# EAGLE design icestampul1k (EAGLE 9.6.2)
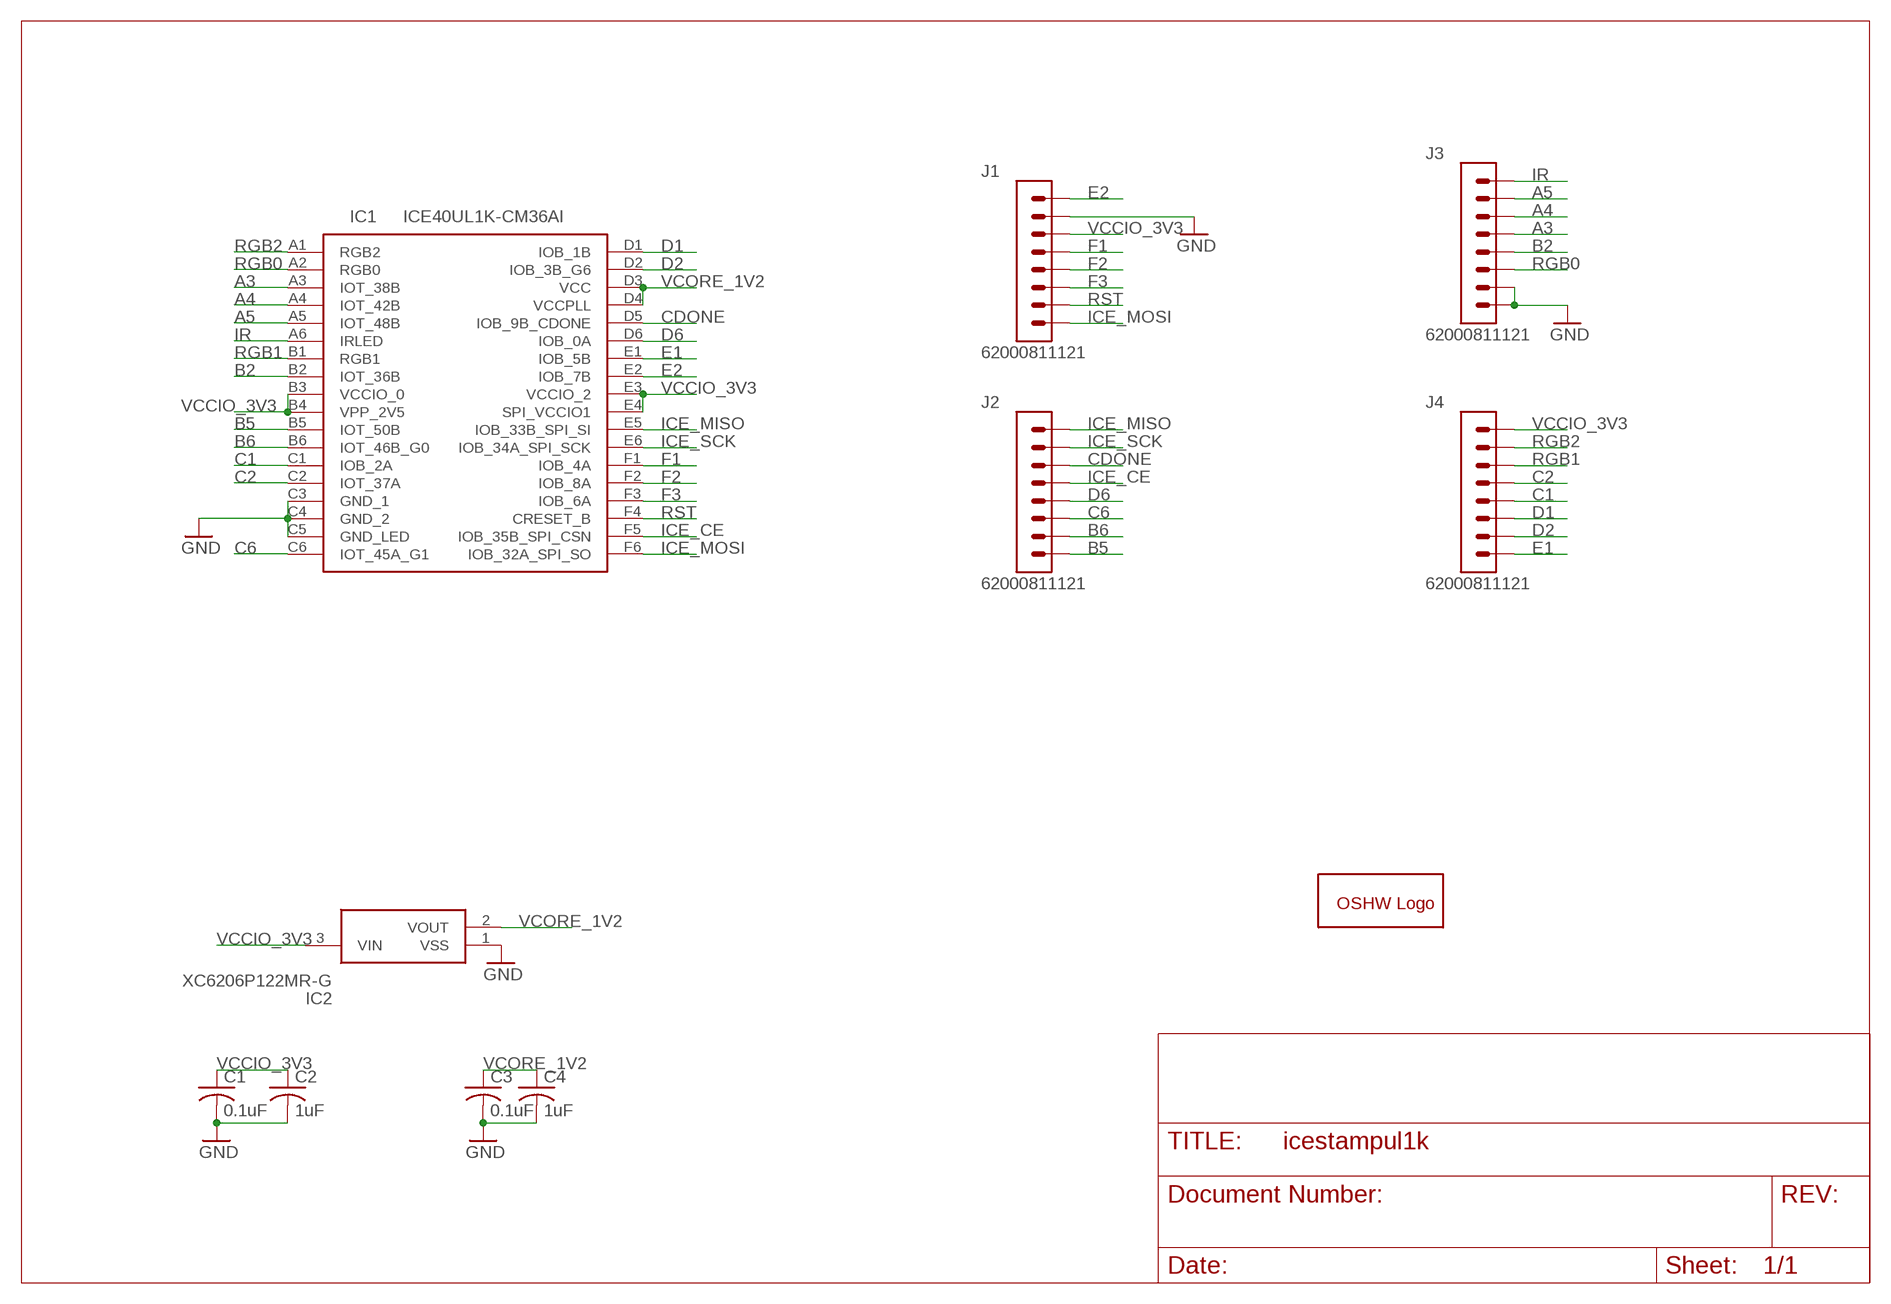
[diagram p0: schematic, sheet 1]

## Parts
C1  0.1uF  C-USC0603  [C0603]
C2  1uF  C-USC0603  [C0603]
C3  0.1uF  C-USC0603  [C0603]
C4  1uF  C-USC0603  [C0603]
GOLD_ORB_SM1  OSHWLOGOLOGO5MM  [OSHW_5MM]
IC1  ICE40UL1K-CM36AI  [BGA36C40P6X6_250X250X91]
IC2  XC6206P122MR-G  [SOT95P280X130-3N]
J1  62000811121  [62000811121]
J2  62000811121  [62000811121]
J3  62000811121  [62000811121]
J4  62000811121  [62000811121]

## Nets
A3: IC1.A3(IOT_38B) J3.4
A4: IC1.A4(IOT_42B) J3.3
A5: IC1.A5(IOT_48B) J3.2
B2: IC1.B2(IOT_36B) J3.5
B5: IC1.B5(IOT_50B) J2.8
B6: IC1.B6(IOT_46B_G0) J2.7
C1: IC1.C1(IOB_2A) J4.5
C2: IC1.C2(IOT_37A) J4.4
C6: IC1.C6(IOT_45A_G1) J2.6
CDONE: IC1.D5(IOB_9B_CDONE) J2.3
D1: IC1.D1(IOB_1B) J4.6
D2: IC1.D2(IOB_3B_G6) J4.7
D6: IC1.D6(IOB_0A) J2.5
E1: IC1.E1(IOB_5B) J4.8
E2: IC1.E2(IOB_7B) J1.1
F1: IC1.F1(IOB_4A) J1.4
F2: IC1.F2(IOB_8A) J1.5
F3: IC1.F3(IOB_6A) J1.6
GND: C1.2 C2.2 C3.2 C4.2 IC1.C3(GND_1) IC1.C4(GND_2) IC1.C5(GND_LED) IC2.1(VSS) J1.2 J3.7 J3.8
ICE_CE: IC1.F5(IOB_35B_SPI_CSN) J2.4
ICE_MISO: IC1.E5(IOB_33B_SPI_SI) J2.1
ICE_MOSI: IC1.F6(IOB_32A_SPI_SO) J1.8
ICE_SCK: IC1.E6(IOB_34A_SPI_SCK) J2.2
IR: IC1.A6(IRLED) J3.1
RGB0: IC1.A2(RGB0) J3.6
RGB1: IC1.B1(RGB1) J4.3
RGB2: IC1.A1(RGB2) J4.2
RST: IC1.F4(CRESET_B) J1.7
VCCIO_3V3: C1.1 C2.1 IC1.B3(VCCIO_0) IC1.B4(VPP_2V5) IC1.E3(VCCIO_2) IC1.E4(SPI_VCCIO1) IC2.3(VIN) J1.3 J4.1
VCORE_1V2: C3.1 C4.1 IC1.D3(VCC) IC1.D4(VCCPLL) IC2.2(VOUT)

## Library data of the parts
C1-C4 = adafruit:C-US: CAPACITOR, American symbol
GOLD_ORB_SM1 = oshw:OSHWLOGO: The OSHW logo for PCB layout
IC1 = ICE40UL1K-CM36AI:ICE40UL1K-CM36AI: FPGA - Field Programmable Gate Array FPGA iCE40-UltraLite 1.2V CBGA PKG Source: Datasheet <http://www.latticesemi.com/~/media/LatticeSemi/Documents/DataSheets/iCE/iCE40UltraLiteDataSheetDS1050.pdf>; ARROW_PART_NUMBER: ICE40UL1K-CM36AI; ARROW_PRICE-STOCK: https://www.arrow.com/en/products/ice40ul1k-cm36ai/lattice-semiconductor; DESCRIPTION: FPGA - Field Programmable Gate Array FPGA iCE40-UltraLite 1.2V CBGA PKG; HEIGHT: 0.91mm; MANUFACTURER_NAME: Lattice Semiconductor; MANUFACTURER_PART_NUMBER: ICE40UL1K-CM36AI; MOUSER_PART_NUMBER: 842-ICE40UL1K-CM36AI; MOUSER_PRICE-STOCK: https://www.mouser.co.uk/ProductDetail/Lattice/ICE40UL1K-CM36AI/?qs=XJu%252BLGjWfSAZhGGFZ7EiQg%3D%3D
IC2 = XC6206P122MR-G:XC6206P122MR-G: LDO Voltage Regulators 1uA Low Quiescent 3 Terminal, Low ESR Cap. Compatible, Voltage Regulator Source: Datasheet <https://www.torexsemi.com/file/xc6206/XC6206.pdf>; DESCRIPTION: LDO Voltage Regulators 1uA Low Quiescent 3 Terminal, Low ESR Cap. Compatible, Voltage Regulator; HEIGHT: 1.3mm; MANUFACTURER_NAME: Torex; MANUFACTURER_PART_NUMBER: XC6206P122MR-G; MOUSER_PART_NUMBER: 865-XC6206P122MR-G; MOUSER_PRICE-STOCK: https://www.mouser.co.uk/ProductDetail/Torex-Semiconductor/XC6206P122MR-G?qs=AsjdqWjXhJ%2F35%2FU%2FZk2JYg%3D%3D
J1-J4 = Headers:62000811121: THT Vertical Pin Header WR-PHD, Pitch 2.00 mm, Single Row, 8 pins Manufacturer's datasheet <https://datasheet.octopart.com/62000811121-W%C3%BCrth-Elektronik-datasheet-117282012.pdf>; CREATED_BY: PCBLayout.com; MANUFACTURER: Würth Elektronik; MPN: 62000811121

## Board
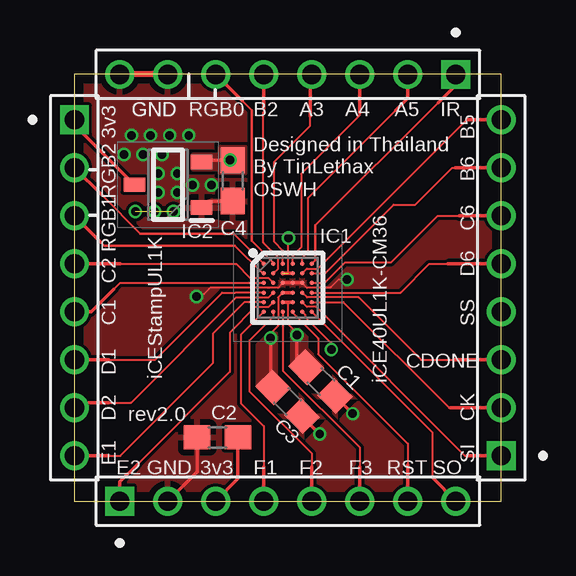
[diagram p1: board, top side]
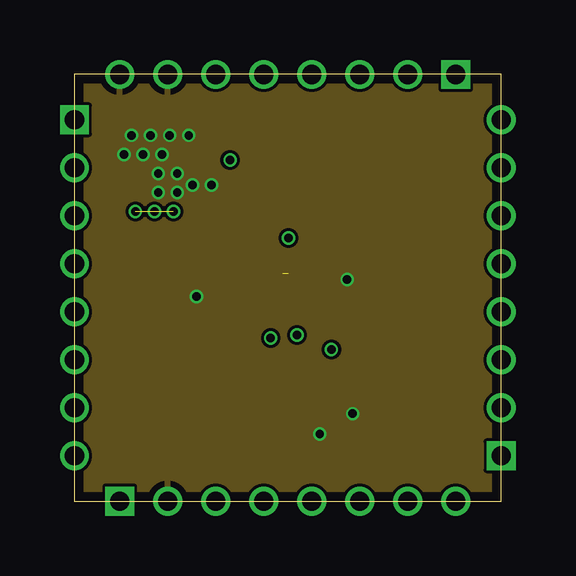
[diagram p2: board, inner layer Route2]
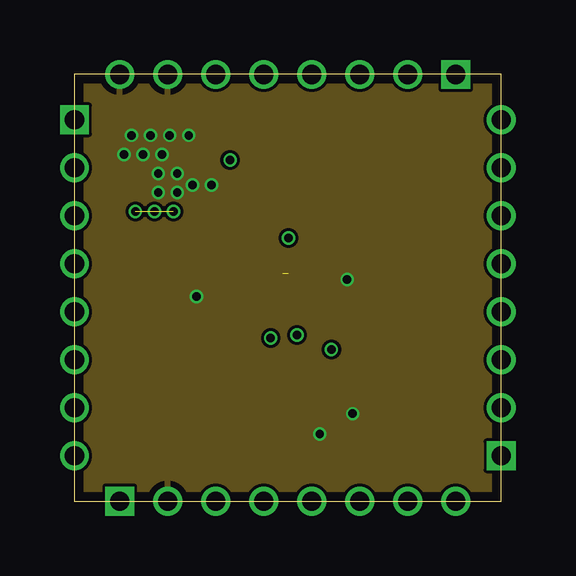
[diagram p3: board, inner layer Route15]
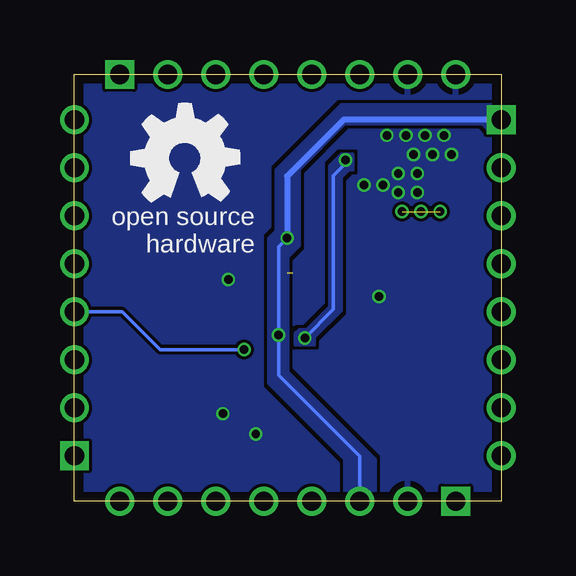
[diagram p4: board, bottom side, seen from below]

Size 17.78 x 17.78 mm. Coordinates in mm from the lower left corner, seen from the top.
Outline: 0,0 17.78,0 17.78,17.78 0,17.78 0,0
Copper layers (1*2*15*16): Top 0.035559375mm / dielectric 0.17018125mm / Route2 0.01778125mm / dielectric 47mil / Route15 0.01778125mm / dielectric 0.17018125mm / Bottom 0.035559375mm
Design rules "oshpark-4layer *": minimum track width 5mil, minimum drill 10mil, track to track 5mil, track to pad 5mil, pad to pad 5mil, via to via 5mil, smd to smd 5mil, copper to edge 15mil, drill to drill 6mil, minimum pad ring 4mil, minimum via ring 4mil, stop-mask expansion 0mil, vias tented up to drill 0mil, thermal gap 10mil

### Footprints (pad centres in the part's own frame; a part is rotated, then mirrored left to right if it is on the bottom)
C0603 = smd 1.1 x 1: 1 -0.85,0; 2 0.85,0
BGA36C40P6X6_250X250X91 = smd 0.18 x 0.18: A1 -1,1; A2 -0.6,1; A3 -0.2,1; A4 0.2,1; A5 0.6,1; A6 1,1; B1 -1,0.6; B2 -0.6,0.6; B3 -0.2,0.6; B4 0.2,0.6; B5 0.6,0.6; B6 1,0.6; C1 -1,0.2; C2 -0.6,0.2; C3 -0.2,0.2; C4 0.2,0.2; C5 0.6,0.2; C6 1,0.2; D1 -1,-0.2; D2 -0.6,-0.2; D3 -0.2,-0.2; D4 0.2,-0.2; D5 0.6,-0.2; D6 1,-0.2; E1 -1,-0.6; E2 -0.6,-0.6; E3 -0.2,-0.6; E4 0.2,-0.6; E5 0.6,-0.6; E6 1,-0.6; F1 -1,-1; F2 -0.6,-1; F3 -0.2,-1; F4 0.2,-1; F5 0.6,-1; F6 1,-1
SOT95P280X130-3N = smd 0.9 x 0.6: 1 -1.4,0.95; 2 -1.4,-0.95; 3 1.4,0
62000811121 = drill 0.8 square: 1 -7,0 | drill 0.8: 2 -5,0; 3 -3,0; 4 -1,0; 5 1,0; 6 3,0; 7 5,0; 8 7,0

### Placement (x,y rotation side)
C1  10.26,4.98 315 top
C2  5.96,2.66 180 top
C3  8.88,4.14 315 top
C4  6.59,13.35 270 top
GOLD_ORB_SM1  13.18,14.29 0 bottom
IC1  8.89,8.89 0 top
IC2  3.9,13.18 180 top
J1  8.89,0 0 top
J2  17.78,8.89 90 top
J3  8.89,17.78 180 top
J4  0,8.89 270 top

### Tracks (layer width: path | path; a pad name or v marks a point on that pad's centre or on a via)
A3
  Top 0.089: IC1.A3 8.69,10.44 8.32,10.81 8.32,14.13 9.82,15.63 9.82,15.88 9.82,16.03 | 9.87,17.76 J3.4
  Top 0.152: 9.82,16.03 9.82,17.71 9.87,17.76
A4
  Top 0.089: 11.89,16.19 11.89,16.08 9.45,13.64 9.45,10.57 9.09,10.21 IC1.A4
  Top 0.152: J3.3 11.89,16.19
A5
  Top 0.089: IC1.A5 9.49,10.14 9.73,10.38 9.73,12.63 13.39,16.29
  Top 0.152: J3.2 13.89,16.79 13.39,16.29
B2
  Top 0.089: IC1.B2 8.49,9.69 8.49,10.15 7.87,10.77 7.87,16.2 7.89,16.22 7.89,16.35
  Top 0.152: J3.5 7.89,16.35
B5
  Top 0.089: IC1.B5 9.69,9.69 10.15,9.69 16.35,15.89
  Top 0.152: J2.8 16.35,15.89
B6
  Top 0.089: IC1.B6 10.45,9.5 13.3,12.35 14.21,12.35 15.74,13.89 15.88,13.89
  Top 0.152: J2.7 15.88,13.89
C1
  Top 0.089: IC1.C1 1.9,9.09 1.65,8.83
  Top 0.152: J4.5 0.7,7.89 1.65,8.83
C2
  Top 0.089: IC1.C2 8.09,9.29 7.33,9.29 6.73,9.89 1.91,9.89
  Top 0.152: J4.4 1.91,9.89
C6
  Top 0.089: IC1.C6 10.42,9.09 11.28,9.94 13.2,9.94 15.14,11.89 16.03,11.89
  Top 0.152: J2.6 16.03,11.89
CDONE
  Top 0.089: IC1.D5 9.69,8.49 11.84,8.49 14.44,5.89 15.88,5.89
  Top 0.152: J2.3 15.88,5.89
D1
  Top 0.089: IC1.D1 6.71,8.69 6.16,8.69 3.36,5.89 1.43,5.89
  Top 0.152: J4.6 1.43,5.89
D2
  Top 0.089: IC1.D2 8.09,8.49 6.75,8.49 2.36,4.1 1.43,4.1
  Top 0.152: J4.7 0.21,4.1 1.43,4.1
D6
  Top 0.089: IC1.D6 13.6,8.69 14.8,9.89 15.56,9.89
  Top 0.152: J2.5 15.56,9.89
E1
  Top 0.089: IC1.E1 7.08,8.29 5.79,6.99 5.79,5.76 1.92,1.89 1.43,1.89
  Top 0.152: J4.8 1.43,1.89
E2
  Top 0.089: IC1.E2 8.09,8.09 7.54,8.09 6.47,7.02 6.47,5.38 2.61,1.52
  Top 0.152: J1.1 1.89,0.8 2.61,1.52
F1
  Top 0.089: IC1.F1 6.93,6.93 6.93,4.08 7.89,3.12 7.89,1.43
  Top 0.152: J1.4 7.89,1.43
F2
  Top 0.089: IC1.F2 8.29,7.68 7.29,6.68 7.29,4.58 9.89,1.98 9.89,1.43
  Top 0.152: J1.5 9.89,1.43
F3
  Top 0.089: IC1.F3 8.69,6.64 | 8.69,6.64 8.69,5.44 11.89,2.24 11.89,1.43 | 8.69,6.64 8.7,6.63
  Top 0.152: J1.6 11.89,1.43
GND  (via drill 0.35)
  Top 0.089: v11.37,9.23 11,9.23 10.65,8.89 9.69,8.89 IC1.C5 | IC1.C3 8.49,8.89 5.65,8.89 5.28,8.52 v5.09,8.52
  Top 0.152: IC1.C3 IC1.C4 IC1.C5 | C1.2 v11.6,3.65 | v11.6,3.65 | C2.2 5.11,1.22 J1.2 | IC2.1 5.57,12.5 C4.2 | C3.2 v10.22,2.79 | v10.22,2.79
  Top 0.254: J3.7 J3.8
  Bottom 0.089: v11.37,9.23 11.35,9.23
  other vias: 4.76,15.24 2.38,15.24 3.17,15.24 3.97,15.24 2.06,14.45 2.86,14.45 3.65,14.45 3.49,13.65 4.29,13.65 3.49,12.86 4.29,12.86 4.92,13.18 5.71,13.18
  pour Bottom (rank 2): 0,17.78 17.78,17.78 17.78,0 0,0
  pour Top (rank 2): 0,17.78 17.78,17.78 17.78,0 0,0
  pour Route2: 0,17.78 17.78,17.78 17.78,0 0,0
  pour Route15: 0,17.78 17.78,17.78 17.78,0 0,0
ICE_CE  (via drill 0.35)
  Top 0.089: IC1.F5 9.62,7.76 9.62,7.67 10.71,6.58 v10.71,6.31
  Bottom 0.152: v10.71,6.31 14.2,6.31 15.78,7.89 J2.4
ICE_MISO
  Top 0.089: IC1.E5 9.69,8.09 10.07,8.09 16.27,1.89 16.34,1.89
  Top 0.152: 16.34,1.89 J2.1
ICE_MOSI
  Top 0.089: IC1.F6 14.93,2.85 14.93,0.96
  Top 0.152: J1.8 14.93,0.96
ICE_SCK
  Top 0.089: IC1.E6 11.21,8.29 15.61,3.89 15.66,3.89
  Top 0.152: 15.66,3.89 J2.2
IR
  Top 0.102: IC1.A6 10.05,10.05 10.05,11.49 15.15,16.6
  Top 0.152: J3.1 15.89,17.34 15.15,16.6
N$5  (via drill 0.35)  (2 unrouted)
  other vias: 2.54,12.06 3.33,12.06 4.13,12.06
RGB0
  Top 0.102: IC1.A2 8.29,9.94 7.39,10.84 7.39,16.28 6.99,16.68
  Top 0.152: J3.6 6.99,16.68
RGB1
  Top 0.102: IC1.B1 7.85,9.49 6.69,10.64 1.25,10.64 1.1,10.79
  Top 0.152: J4.3 1.1,10.79
RGB2
  Top 0.102: IC1.A1 6.63,11.15 2.74,11.15 1.15,12.74
  Top 0.152: J4.2 1.15,12.74
RST
  Top 0.089: IC1.F4 9.09,7.85 10.16,6.78 10.16,6.13 13.89,2.4 13.89,1.52
  Top 0.152: 13.89,1.52 J1.7
VCCIO_3V3  (via drill 0.35)  (1 unrouted)
  Top 0.089: 8.89,8.29 8.89,7.39 9.27,7.01 v9.27,6.92 | 8.89,9.49 8.89,10.94 v8.91,10.96
  Top 0.152: IC1.E3 8.89,8.29 IC1.E4 | IC1.B3 8.89,9.49 | 8.9,9.49 IC1.B4 | C1.1 9.27,5.97 v9.27,6.92 | C2.1 6.81,0.92 J1.3 | IC2.3 0,15.68 J4.1
  Bottom 0.152: v8.91,10.96 9.27,10.6 v9.27,6.92 9.27,5.25 5.89,1.86 J1.3
  Bottom 0.254: J4.1 6.54,15.89 6.55,15.9 8.91,13.54 v8.91,10.96
  pour Top (no thermals): 9.05,5.56 9.05,7.14 9.37,7.14 9.68,6.83 9.68,6.35 10.32,5.71 10.32,5.56 9.68,4.92
  pour Bottom (no thermals): 5.24,0 6.51,0 6.51,1.75 9.68,4.92 9.68,10.79 9.68,10.95 9.37,11.27 9.37,13.81 6.83,16.35 6.67,16.51 0,16.51 0,15.4 0.48,15.4 0.79,15.72 0.95,15.72 6.51,15.72 8.41,13.81 8.41,10.64 8.89,10.16 8.89,5.4 5.24,1.75
VCORE_1V2  (via drill 0.35)
  Top 0.089: IC1.D3 8.49,8.49 8.49,7.31 8.18,7 v8.18,6.79
  Top 0.152: IC1.D3 IC1.D4 | IC2.2 5.37,14.2 C4.1 6.5,14.2 v6.49,14.22 | C3.1 8.18,4.84 v8.18,6.79
  Bottom 0.152: v6.49,14.22 6.49,14.06 6.99,13.56 6.99,7.99 v8.18,6.79
  pour Top (no thermals): 7.62,4.92 7.62,6.51 7.78,6.67 8.1,6.99 8.41,6.99 8.41,5.4 8.41,5.24 8.89,4.76 8.26,4.13 7.62,4.76
  pour Bottom (no thermals): 6.19,14.45 6.67,14.45 7.14,13.97 7.14,13.65 7.14,8.1 8.1,7.14 8.41,7.14 8.57,6.99 8.57,6.51 7.78,6.51 7.78,6.83 6.67,7.94 6.67,13.49 6.35,13.81 6.19,13.81
  pour Top (no thermals): 4.92,14.45 5.71,14.45 6.03,14.45 6.03,14.76 7.14,14.76 7.14,13.65 6.03,13.65 6.03,13.81 4.92,13.81

### Text on the board
tNames: 3v3 | GND | GND | RGB0 | B2 | A3 | A4 | A5 | IR | RGB2 | B5 | Designed in Thailand / By TinLethax | RGB1 | OSWH | B6 | C6 | C2 | D6 | C1 | SS | D1 | CDONE | iCEStampUL1K | iCE40UL1K-CM36 | D2 | E1 | rev2.0 | CK | SI | E2 | GND | 3v3 | F1 | F2 | F3 | RST | SO